# Altium schematic sheet teensy.SchDoc
size A4; SheetNumber: 3; SheetTotal: 3
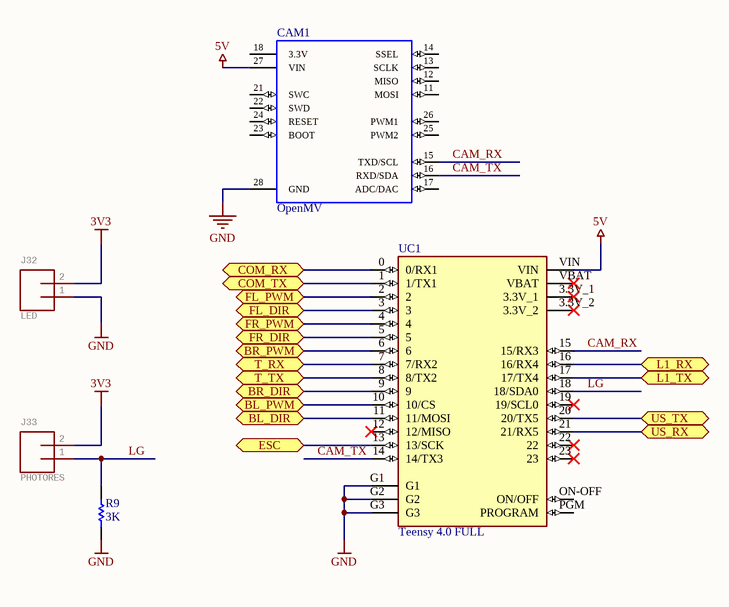
[diagram p0: teensy.SchDoc]

## Parts
CAM1  OpenMV  [OPENMV3]
J32  LED  [1X02_LOCK]
J33  PHOTORES  [1X02_LOCK]
R9  3K  [RES0603]
UC1  Teensy 4.0 FULL  [MODULE_DEV-15583]

## Ports
BL_DIR (bidir), BL_PWM (bidir), BR_DIR (bidir), BR_PWM (bidir), COM_RX (bidir), COM_TX (bidir), ESC (bidir), FL_DIR (bidir), FL_PWM (bidir), FR_DIR (bidir), FR_PWM (bidir), L1_RX (bidir), L1_TX (bidir), T_RX (bidir), T_TX (bidir), US_RX (bidir), US_TX (bidir)

## Nets
3V3: J32.2 J33.2
5V: CAM1.27(VIN) UC1.VIN
GND: CAM1.28(GND) J32.1 R9.1 UC1.G1 UC1.G2 UC1.G3
BL_DIR: UC1.11(11/MOSI) ; port BL_DIR
BL_PWM: UC1.10(10/CS) ; port BL_PWM
BR_DIR: UC1.9 ; port BR_DIR
BR_PWM: UC1.6 ; port BR_PWM
CAM_RX: CAM1.15(TXD/SCL) UC1.15(15/RX3)
CAM_TX: CAM1.16(RXD/SDA) UC1.14(14/TX3)
COM_RX: UC1.0(0/RX1) ; port COM_RX
COM_TX: UC1.1(1/TX1) ; port COM_TX
ESC: UC1.13(13/SCK) ; port ESC
FL_DIR: UC1.3 ; port FL_DIR
FL_PWM: UC1.2 ; port FL_PWM
FR_DIR: UC1.5 ; port FR_DIR
FR_PWM: UC1.4 ; port FR_PWM
L1_RX: UC1.16(16/RX4) ; port L1_RX
L1_TX: UC1.17(17/TX4) ; port L1_TX
LG: J33.1 R9.2 UC1.18(18/SDA0)
T_RX: UC1.7(7/RX2) ; port T_RX
T_TX: UC1.8(8/TX2) ; port T_TX
US_RX: UC1.21(21/RX5) ; port US_RX
US_TX: UC1.20(20/TX5) ; port US_TX

Not connected (* = marked no-connect by the designer): CAM1 11(MOSI) 12(MISO) 13(SCLK) 14(SSEL) 17(ADC/DAC) 18(3.3V) 21(SWC) 22(SWD) 23(BOOT) 24(RESET) 25(PWM2) 26(PWM1); UC1 3.3V_1* 3.3V_2* 12(12/MISO)* 19(19/SCL0)* 22* 23* ON-OFF(ON/OFF) PGM(PROGRAM) VBAT*

## Library data of the parts
J32 J33 = CONN_02LOCK: GateName_1: G$1; DeviceName: LOCK; LibraryName: SparkFun-Connectors; Source: SparkFun-Connectors.SCHLIB; Pin Count: 2; Component Type: Standard; Design Item ID: CONN_02LOCK; DeviceSetName: CONN_02; SymbolName_1: CONN_02; Package: 1X02_LOCK
R9 = RES0603: Resistor
UC1 = Teensy 4.0: RT1062 Teensy 4.0 i.MX ARMÂ® CortexÂ®-M7 MPU Embedded Evaluation Board; MP: DEV-15583; MF: SparkFun Electronics; Component Type: Standard; Digi-Key_Part_Number: 1568-DEV-15583-ND; Source: SnapEDAsch.SchLib; Pin Count: 33; Design Item ID: DEV-15583; Package: None; SnapEDA_Link: https://www.snapeda.com/parts/DEV-15583/SparkFun%20Electronics/view-part/4001229/?ref=snap; Digi-Key_Purchase_URL: https://www.digikey.com/product-detail/en/sparkfun-electronics/DEV-15583/1568-DEV-15583-ND/10384551?utm_source=snapeda&utm_medium=aggregator&utm_campaign=symbol; Value: *